# EAGLE design vibroboard2 (EAGLE 7.4.0)
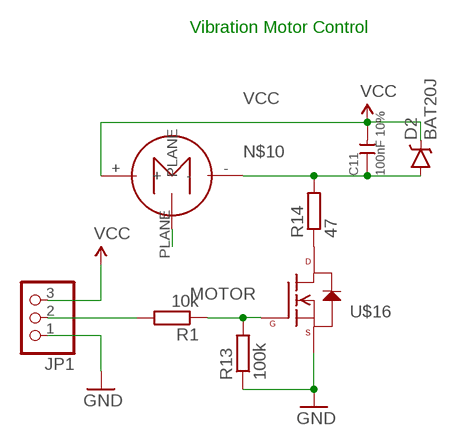
[diagram p0: schematic, sheet 1]

## Parts
C11  100nF 10%  CAP-0603  [C0603]
D2  BAT20J  DIODE-SCHOTTKY-BAT20J  [SOD-323]
JP1  PINHD-1X3  [1X03]
R1  10k  R-EU_R0603  [R0603]
R13  100k  R-EU_R0603  [R0603]
R14  47  R-EU_R0603  [R0603]
U$16  N-CHANNEL-MOSFET-BSS138  [SOT23-3]
U$23  VIBRO  [VIBRO]

## Nets
GND: JP1.1 R13.1 U$16.2(S)
MOTOR: R1.1 R13.2 U$16.1(G)
N$1: JP1.2 R1.2
N$4: R14.1 U$16.3(D)
N$10: C11.1 D2.A R14.2 U$23.-
PLANE: U$23.PLANE
VCC: C11.2 D2.C JP1.3 U$23.+

## Notes on the sheet
- Vibration Motor Control

## Library data of the parts
C11 = Discrete-new:CAP: Ceramic Capacitors
D2 = SparkFun-DiscreteSemi:DIODE-SCHOTTKY: Schottky diodes in SFE's production catalog BAT20J 1A 23V 0.62Vf RB751 120mA 40V 0.37Vf PMEG4005EJ 0.5A 40V 0.42Vf MBRA140 1A 40V 0.5Vf B340A 3A 40V SMA; PROD_ID: DIO-11623
JP1 = adafruit:PINHD-1X3: PIN HEADER
R1 R13 R14 = rcl:R-EU_: RESISTOR, European symbol
U$16 = GeekAmmo:N-CHANNEL-MOSFET: N-Channel MOSFET Mode Field Effect Transistor; DATASHEET: http://www.fairchildsemi.com/ds/BS/BSS138.pdf; DIGIKEY: BSS138TR-ND; ELEMENT14: 2323154; URL: http://au.element14.com/fairchild-semiconductor/bss138/mosfet-n-ch-50v-220ma-sot-23/dp/2323154
U$23 = vibro:VIBRO

## Board
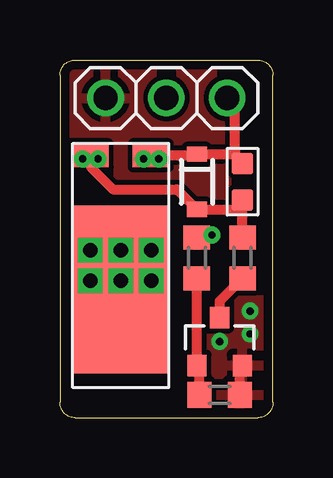
[diagram p1: board, top side]
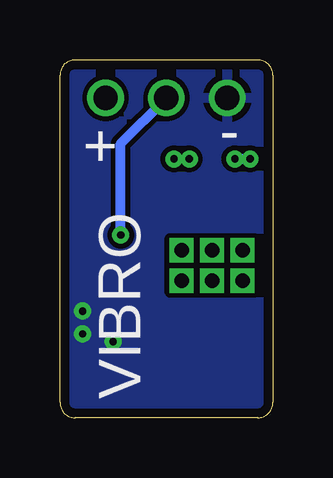
[diagram p2: board, bottom side, seen from below]

Size 8.89 x 14.92 mm. Coordinates in mm from the lower left corner, seen from the top.
Outline: 0.64,0 8.26,0 arc90 8.89,0.64 8.89,14.29 arc90 8.26,14.92 0.64,14.92 arc90 0,14.29 0,0.64 arc90 0.64,0
Copper layers (1*16): Top 0.035mm / dielectric 1.5mm / Bottom 0.035mm
Design rules "default *": minimum track width 10mil, minimum drill 24mil, track to track 8mil, track to pad 8mil, pad to pad 8mil, via to via 8mil, smd to smd 8mil, copper to edge 15mil, drill to drill 8mil, minimum pad ring 10mil, minimum via ring 8mil, stop-mask expansion 4mil, vias tented up to drill 19mil, thermal gap 10mil

### Footprints (pad centres in the part's own frame; a part is rotated, then mirrored left to right if it is on the bottom)
C0603 = smd 0.889 x 0.889: 1 0,0.762; 2 0,-0.762
SOD-323 = smd 0.63 x 0.83: A 1.15,0; C -1.15,0
1X03 = drill 1.016: 1 -2.54,0; 2 0,0; 3 2.54,0
R0603 = smd 1 x 1.1: 1 -0.85,0; 2 0.85,0
SOT23-3 = smd 0.8 x 0.9: 1 -0.95,-1; 2 0.95,-1; 3 0,1
VIBRO = smd 1 x 1.5: + -4.6,1.25; - -4.6,-1.25 | smd 7 x 4: PLANE 1,0

### Placement (x,y rotation side)
C11  7.62,9.84 180 top
D2  5.71,9.84 270 top
JP1  4.45,13.33 0 top
R1  5.71,6.67 90 top
R13  6.67,0.95 180 top
R14  7.62,6.67 90 top
U$16  6.67,3.17 0 top
U$23  2.54,6.35 270 top

### Tracks (layer width: path | path; a pad name or v marks a point on that pad's centre or on a via)
GND  (via drill 0.3)
  Top 0.406: R13.1 7.52,2.08 U$16.2
  other vias: 7.94,3.49 6.67,3.17 7.94,4.45
  pour Top: -1.91,16.51 -1.91,-0.95 10.16,-0.95 10.16,16.83 -1.91,16.83
  pour Bottom: -0.64,15.56 -0.64,-0.32 9.53,-0.32 9.53,15.56
MOTOR
  Top 0.406: R13.2 5.82,2.08 U$16.1 5.72,2.86 5.71,3.17 R1.1
N$1  (via drill 0.3)
  Top 0.406: R1.2 6.25,7.52 v6.35,7.62
  Bottom 0.406: v6.35,7.62 6.35,11.43 JP1.2
N$4
  Top 0.406: U$16.3 6.67,4.87 R14.1
N$10  (via drill 0.3 pad 0.3)
  Top 0.406: v1.59,10.79 1.45,10.79 U$23.- 1.29,10.46 2.22,9.53 4.88,9.53 D2.A 7.23,8.69 C11.1 R14.2
  Bottom 0.406: v0.95,10.79 v1.59,10.79
PLANE  (via drill 0.6 pad 0.3)
  Top 0.406: U$23.PLANE 1.27,6.62 v1.27,6.98 v1.27,5.71 2.54,4.45 v3.81,5.71 | v3.81,5.71 v3.81,6.98 v2.54,6.98 v2.54,5.71 v3.81,5.71
VCC  (via drill 0.3 pad 0.3)
  Top 0.406: U$23.+ 5.67,10.95 D2.C | D2.C 7.23,10.99 C11.2 | D2.C 7.18,10.99 7.3,11.11 7.3,13.02 JP1.3 | v3.49,10.79 3.63,10.79 U$23.+ | v4.13,10.79 3.94,10.79 U$23.+

### Text on the board
bPlace: - | + | VIBRO